# Altium project airu-board.PrjPcb
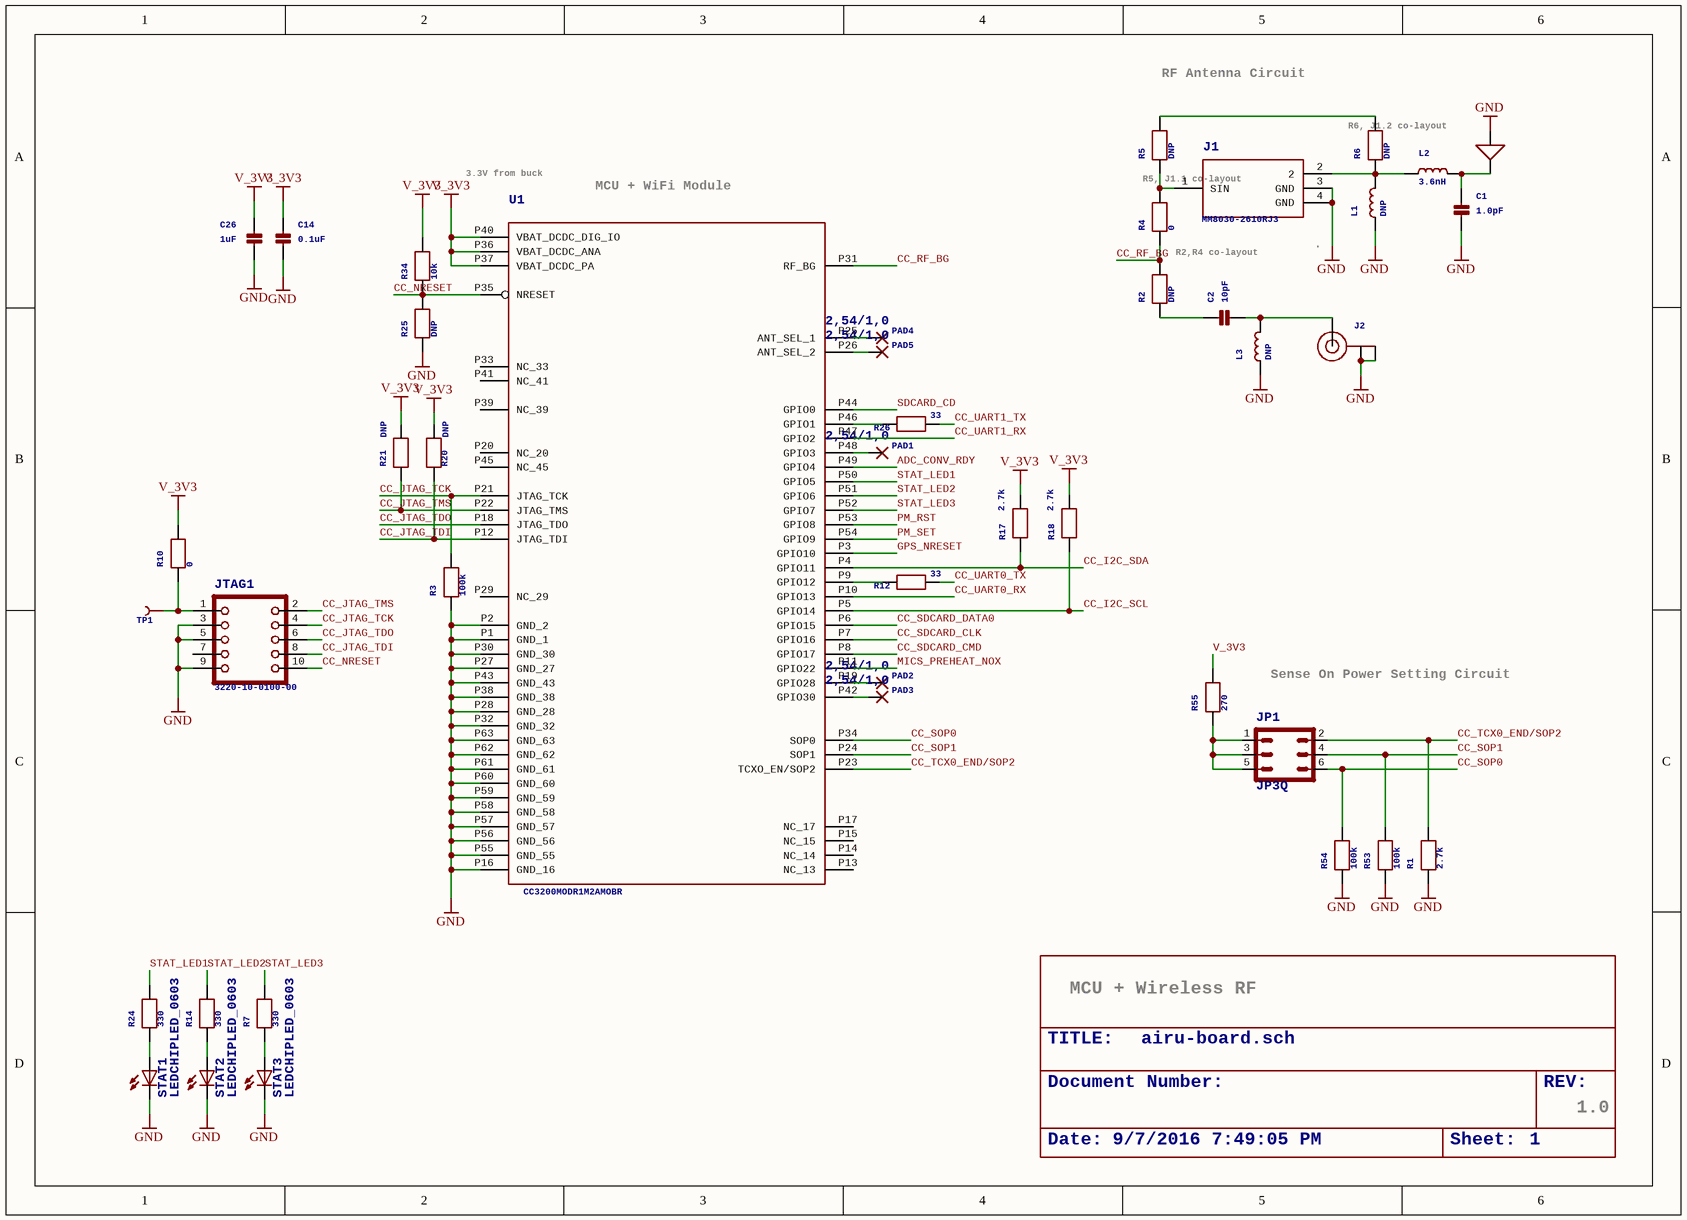
[diagram p0: airu-board_0.SchDoc]
3 sheets, 116 parts. Net scope: global (net labels, ports and power ports of the same name join across sheets).
Board file: airu-board.PcbDoc
Sheets:
  airu-board_0.SchDoc
  airu-board_1.SchDoc
  airu-board_2.SchDoc

## Sheet airu-board_0.SchDoc
size 296 x 213 mm

### Parts
C1  1.0pF  [0402]
C2  10pF  [0402]
C14  0.1uF  [0402]
C26  1uF  [0402]
E1  AH316M245001-T  [AH316M]  (value not drawn)
FRAME1  FRAME_A_L  (value not drawn)  (parts A,B of 2)
J1  MM8030-2610RJ3  [MURATA_MM8030-2610RJ3]
J2  U.FL-R-SMT-1(10)  [U.FL]  (value not drawn)
JP1  JP3Q  [JP3Q]
JTAG1  3220-10-0100-00  [CORTEXM3_SWD10_MOLEX]
L1  DNP  [_0402]
L2  3.6nH  [_0402]
L3  DNP  [_0402]
PAD1  2,54/1,0  [2,54/1,0]
PAD2  2,54/1,0  [2,54/1,0]
PAD3  2,54/1,0  [2,54/1,0]
PAD4  2,54/1,0  [2,54/1,0]
PAD5  2,54/1,0  [2,54/1,0]
R1  2.7k  [0402]
R2  DNP  [0402]
R3  100k  [0402]
R4  0  [0402]
R5  DNP  [0402]
R6  DNP  [0402]
R7  330  [0402]
R10  0  [0402]
R12  33  [0402]
R14  330  [0402]
R17  2.7k  [0402]
R18  2.7k  [0402]
R20  DNP  [0402]
R21  DNP  [0402]
R24  330  [0402]
R25  DNP  [0402]
R26  33  [0402]
R34  10k  [0402]
R53  100k  [0402]
R54  100k  [0402]
R55  270  [0402]
STAT1  LEDCHIPLED_0603  [CHIPLED_0603]
STAT2  LEDCHIPLED_0603  [CHIPLED_0603]
STAT3  LEDCHIPLED_0603  [CHIPLED_0603]
TP1  TEST-POINT2  [PAD.02X.02]  (value not drawn)
U1  CC3200MODR1M2AMOBR  [CC3200MOD]

### Nets
GND: C1.2(P$2) C14.2(P$2) C26.2(P$2) E1.P$2 J1.3(GND) J1.4(GND) J2.1(GND) J2.2(GND) JTAG1.3 JTAG1.5 JTAG1.9 L1.1 L3.1 R1.1 R3.1 R25.1 R53.1 R54.1 STAT1.C STAT2.C STAT3.C U1.P1(GND_1) U1.P2(GND_2) U1.P16(GND_16) U1.P27(GND_27) U1.P28(GND_28) U1.P30(GND_30) U1.P32(GND_32) U1.P38(GND_38) U1.P43(GND_43) U1.P55(GND_55) U1.P56(GND_56) U1.P57(GND_57) U1.P58(GND_58) U1.P59(GND_59) U1.P60(GND_60) U1.P61(GND_61) U1.P62(GND_62) U1.P63(GND_63)
V_3V3: C14.1(P$1) C26.1(P$1) R10.2 R17.2 R18.2 R20.2 R21.2 R34.2 R55.2 U1.P36(VBAT_DCDC_ANA) U1.P37(VBAT_DCDC_PA) U1.P40(VBAT_DCDC_DIG_IO)
ADC_CONV_RDY: U1.P49(GPIO4)
CC_I2C_SCL: R18.1 U1.P5(GPIO14)
CC_I2C_SDA: R17.1 U1.P4(GPIO11)
CC_JTAG_TCK: JTAG1.4 R3.2 U1.P21(JTAG_TCK)
CC_JTAG_TDI: JTAG1.8 R20.1 U1.P12(JTAG_TDI)
CC_JTAG_TDO: JTAG1.6 U1.P18(JTAG_TDO)
CC_JTAG_TMS: JTAG1.2 R21.1 U1.P22(JTAG_TMS)
CC_NRESET: JTAG1.10 R25.2 R34.1 U1.P35(NRESET)
CC_RF_BG: R2.2 R4.1 U1.P31(RF_BG)
CC_SDCARD_CLK: U1.P7(GPIO16)
CC_SDCARD_CMD: U1.P8(GPIO17)
CC_SDCARD_DATA0: U1.P6(GPIO15)
CC_SOP0: JP1.6 R54.2 U1.P34(SOP0)
CC_SOP1: JP1.4 R53.2 U1.P24(SOP1)
CC_TCX0_END/SOP2: JP1.2 R1.2 U1.P23(TCXO_EN/SOP2)
CC_UART0_RX: U1.P10(GPIO13)
CC_UART0_TX: R12.2
CC_UART1_RX: U1.P47(GPIO2)
CC_UART1_TX: R26.2
GPS_NRESET: U1.P3(GPIO10)
MICS_PREHEAT_NOX: U1.P11(GPIO22)
PM_RST: U1.P53(GPIO8)
PM_SET: U1.P54(GPIO9)
SDCARD_CD: U1.P44(GPIO0)
STAT_LED1: R24.2 U1.P50(GPIO5)
STAT_LED2: R14.2 U1.P51(GPIO6)
STAT_LED3: R7.2 U1.P52(GPIO7)
NetC1_1: C1.1(P$1) E1.P$1 L2.2
NetC2_1: C2.1(P$1) R2.1
NetC2_2: C2.2(P$2) J2.3(SIGNAL) L3.2
NetJ1_1: J1.1(SIN) R4.2 R5.1
NetJ1_2: J1.2 L1.2 L2.1 R6.1
NetJP1_1: JP1.1 JP1.3 JP1.5 R55.1
NetJTAG1_1: JTAG1.1 R10.1 TP1.P$1
NetPAD1_1: PAD1.1(P) U1.P48(GPIO3)
NetPAD2_1: PAD2.1(P) U1.P19(GPIO28)
NetPAD3_1: PAD3.1(P) U1.P42(GPIO30)
NetPAD4_1: PAD4.1(P) U1.P25(ANT_SEL_1)
NetPAD5_1: PAD5.1(P) U1.P26(ANT_SEL_2)
NetR5_2: R5.2 R6.2
NetR7_1: R7.1 STAT3.A
NetR12_1: R12.1 U1.P9(GPIO12)
NetR14_1: R14.1 STAT2.A
NetR24_1: R24.1 STAT1.A
NetR26_1: R26.1 U1.P46(GPIO1)

Not connected (* = marked no-connect by the designer): JTAG1 7; U1 P13(NC_13) P14(NC_14) P15(NC_15) P17(NC_17) P20(NC_20) P29(NC_29) P33(NC_33) P39(NC_39) P41(NC_41) P45(NC_45)

### Notes on the sheet
- (near R5) RF Antenna Circuit
- (near R6) R6, J1.2 co-layout
- 3.3V from buck
- (near U1) MCU + WiFi Module
- (near J1) R5, J1.1 co-layout
- R2,R4 co-layout
- Sense On Power Setting Circuit
- MCU + Wireless RF
- 1.0

### Library data of the parts
C1 C2 C14 C26 = CAP_CERAMIC0402: <p><b>Ceramic Capacitors</b></p> / <b>0402</b> - 0402 Surface Mount Capacitors / <ul> / <li>16pF 50V 5% [Digikey: 445-4899-2-ND]</li> / <li>18pF 50V 5% [Digikey: 490-1281-2-ND]</li> / <li>22pF 50V 5% [Digikey: 490-1283-2-ND]</li> / <li>68pF 50V 5% [Digikey: 490-1289-2-ND]</li> / <li>0.1uF 10V 10% [Digikey: 490-1318-2-ND]</li> / <li>1.0uF 6.3V 10% [Digikey: 490-1320-2-ND]</li> / </ul> / <b>0603</b> - 0603 Surface Mount Capacitors / <ul> / <li>16 pF 50V 5% [Digikey: 445-5051-2-ND]</li> / <li>22 pF 50V [Digikey: PCC220ACVTR-ND]</li> / <li>33 pF 50V 5% [Digikey: 490-1415-1-ND]</li> / <li>56pF 50V 5% [Digikey: 490-1421-1-ND]</li> / <li>220pF 50V 5% [Digikey: 445-1285-1-ND]</li> / <li>680 pF 50V </li> / <li>2200 pF 50V 5% C0G [Digikey: 445-1297-1-ND]</li> / <li>5600 pF 100V 5% X7R [Digikey: 478-3711-1-ND]</li> / <li>0.1 µF 25V 10% [Digikey: PCC2277TR-ND]</li> / <li>0.22 µF 16V 10% X7R [Digikey: 445-1318-1-ND]</li> / <li>1.0 µF 25V 10% [Digikey: 445-5146-2-ND]</li> / </ul> / <b>0603</b> - RF Specific / <ul> / <li>3pF 250V +/-0.1pF RF [Digikey: 712-1347-1-ND]</li> / <li>18 pF 250V 5%  [Digikey: 478-3505-1-ND or 712-1322-1-ND]</li> / <li>56 pF 250V 5% C0G RF [Digikey: 490-4867-1-ND]</li> / <li>68 pF 250V RF [Digikey: 490-4868-1-ND]</li> / </ul> / <b>0805</b> - 0805 Surface Mount Capacitors / <ul> / <li>220 pF 250V 2% <strong>RF</strong> Ceramic Capacitor [Digikey: 712-1398-1-ND]</li> / <li>1000 pF 50V 2% NP0 Ceramic Capacitor [Digikey: 478-3760-1-ND]</li> / <li>0.1 µF 25V 10% Ceramic Capacitor [Digikey: PCC1828TR-ND]</li> / <li>1.0 µF 16V 10% Ceramic Capacitor[Digikey: 490-1691-2-ND]</li> / <li>10.0 µF 10V 10% Ceramic Capacitor[Digikey: 709-1228-1-ND]</li> / <li>10.0 uF 16V 10% Ceramic Capacitor [Digikey: 478-5165-2-ND]</li> / <li>47 uF 6.3V 20% Ceramic Capacitor [Digikey: 587-1779-1-ND or 399-5506-1-ND]</li> / </ul> / </ul><b>1206</b> - 1206 Surface Mount Capacitors / <ul> / <li>47uF 10V 20% Ceramic Capacitor [Digikey: 490-5528-1-ND or 399-5508-1-ND or 445-6010-1-ND]</li> / <li>100uF 6.3V -20%, +80% Y5V Ceramic Capacitor (Digikey: 490-4512-1-ND, Mouser: 81-GRM31CF50J107ZE1L)</li> / </ul>
E1 = AH316M245001-T: ANT BLUETOOTH W-LAN ZIGBEE WIMAX
FRAME1 = FRAME_A_L: <b>FRAME</b> A Size , 8 1/2 x 11 INCH, Landscape<p>
J1 = MM8030-2610RJ3: Conn Coaxial RCP 0Hz to 11GHz 50Ohm Solder ST SMD Gold Reel
J2 = U.FL: <p>U.FL Antenna Connector</p>
JP1 = JP3Q: <b>JUMPER</b>
JTAG1 = JTAG-CORTEXM3MOLEX: <p><b>Serial Wire (SW-DP) Connector</b></p> / This standard 0.05" 10-pin connector is for use with the Cortex M0/M3's native SWD (serial wire debugger) interface (SW-DP).  Some boards support a 20-pin combined JTAG+SWD connector (SWJ-DP), such as the LPC1700 family, but many smaller devices only work with SWD which typically use the smaller 10-pin SW-DP connecter (the LPC1300 family, for example, only supports SWD). / <p><b>2x05 1.27mm/0.05" Connector:</b> This is the standard SMT connector defined by ARM for all Cortex devices, and should be used in most situations and for forward-compatibility since any new devices coming to market will likely use this connector.</p> / <p><b>MOLEX 10 Pin 0.1" Connector:</b> This 0.1" 10 pin connector has the same pin layout as the standard 0.05" connector, but is easier to work with if you are using standard jumper wires or custom cables to connect your SWD hardware.</p> / <p><b>MOLEX 20 Pin 0.1" Connector:</b> This 0.1" 20 pin connector is the same model used for ARM7/ARM9 JTAG debuggers, but is connected to match the pins on the Segger J-Link for ARM (which supports both JTAG and SWD debugging).</p> / <p>See the following document from ARM for more information on Cortex M3 Debug Connectors: http://infocenter.arm.com/help/topic/com.arm.doc.faqs/attached/13634/cortex_debug_connectors.pdf<br/>And the following page for an overview with images of the different connector types: http://www.keil.com/peripherals/coresight/connectors.asp</p>
L1-L3 = INDUCTOR_0402: <b>Inductors</b> / <p>0603:</p> / <ul> / <li>10nH Ceramic Inductor - microwire antenna/RF (Digikey: 712-1434-2-ND)</li> / </ul> / <p>0805:</p> / <ul> / <li>560nH Ceramic Inductor - RF (Digikey: 553-1047-1-ND)</li> / <li>270nH Ceramic Inductor - Q = 40@250MHz, +-5%, 1 Ohm DC Resistance (Digikey: 535-10506-2-ND)</li> / </ul> / <p>1007 (2518 Metric) SMT:</p> / <ul> / <li>10µH 10% 250mOhm 820mA 1007 Inductor (Digikey: 587-2189-1-ND)</li> / <li>22µH 10% 500mOhm 580mA 1007 Inductor (Digikey: 587-2190-1-ND)</li> / <li>47µH 10% 950mOhm 420mA 1007 Inductor (Digikey: 587-2191-1-ND)</li> / <li>47µH 5% 100mOhm 1A 1008 Inductor (Digikey: 732-1816-1-ND)</li> / </ul> / <p>5.0x5.0mm (Taiyo Yuden NR5040 Series)</p> / <ul> / <li>6.8µH 20% 2.3A 64mOhm Inductor (Digikey: 587-2374-2-ND)</li> / </ul> / <p>5.0x5.0mm (TDK VLC5045 Series)</p> / <ul> / <li>4.7µH 20% 3.3A 34mOhm Inductor (Digikey: 445-6526-1-ND)</li> / <li>6.8µH 20% 2.7A 46mOhm Inductor (Digikey: 445-6527-1-ND)</li> / </ul> / <p>6.0x6.0mm (TDK VLC6045 Series)</p> / <ul> / <li>4.7µH 20% 3.8A 27mOhm Inductor (Digikey: 445-6538-2-ND)</li> / <li>6.8µH 20% 3A 41mOhm Inductor (Digikey: 445-6540-1-ND)</li> / <li>6.2µH 30% 2.2A 45mOhm Inductor (Digikey: SRR5028-6R2YCT-ND) - Not TDK VLC6045 but footprint should match</li> / </ul> / <p>6.0x6.0mm (TDK SLF6045 Series)</p> / <ul> / <li>6.8uH 30% 2A 33mOhm Inductor (Digikey: 445-4572-1-ND, Mouser: 810-SLF645T6R8N2R0PF)</li> / </ul>
PAD1-PAD5 = 2,54/1,0: <b>THROUGH-HOLE PAD</b>
R1-R7 R10 R12 R14 R17 R18 R20 R21 R24-R26 R34 R53-R55 = RESISTOR0402: <p><b>Resistors</b></p> / <b>0402</b> - 0402 Surface Mount Package / <ul> / <li>22 Ohm 1% 1/16W [Digikey: 311-22.0LRTR-ND]</li> / <li>33 Ohm 5% 1/16W</li> / <li>1.0K 5% 1/16W</li> / <li>1.5K 5% 1/16W</li> / <li>2.0K 1% 1/16W</li> / <li>10.0K 1% 1/16W [Digikey: 311-10.0KLRTR-ND]</li> / <li>10.0K 5% 1/16W [Digikey: RMCF0402JT10K0TR-ND]</li> / <li>12.1K 1% 1/16W [Digikey: 311-22.0LRTR-ND]</li> / <li>100.0K 5% 1/16W</li> / </ul> / <b>0603</b> - 0603 Surface Mount Package<br> / <ul> / <li>0 Ohm 1/10 Watt 1% Resistor</li> / <li>15 Ohm 1/10 Watt 1% Resistor</li> / <li>33 Ohm 1/10 Watt 1% Resistor</li> / <li>49.9 Ohm 1/10 Watt 1% Resistor</li> / <li>100 Ohm 1/10 Watt 1% Resistor</li> / <li>150 Ohm 1/10 Watt 1% Resistor</li> / <li>240 Ohm 1/10 Watt 1% Resistor</li> / <li>390 Ohm 1/10 Watt 1% Resistor</li> / <li>560 Ohm 1/10 Watt 1% Resistor</li> / <li>680 Ohm 1/10 Watt 1% Resistor</li> / <li>750 Ohm 1/10 Watt 1% Resistor</li> / <li>1.0K Ohm 1/10 Watt 1% Resistor</li> / <li>1.5K Ohm 1/10 Watt 1% Resistor</li> / <li>2.0K Ohm 1/10 Watt 1% Resistor</li> / <li>2.2K Ohm 1/10 Watt 1% Resistor</li> / <li>3.3K Ohm 1/10 Watt 1% Resistor</li> / <li>4.7K Ohm 1/10 Watt 1% Resistor</li> / <li>10.0K Ohm 1/10 Watt 1% Resistor</li> / <li>12.0K Ohm 1/10 Watt 1% Resistor</li> / <li>12.1K Ohm 1/10 Watt 1% Resistor</li> / <li>20.0K Ohm 1/10 Watt 1% Resistor</li> / <li>33.0K Ohm 1/10 Watt 1% Resistor</li> / <li>100.0K Ohm 1/10 Watt 1% Resistor</li> / </ul> / <b>0805</b> - 0805 Surface Mount Package / <ul> / <li>0 Ohm 1/8 Watt 1% Resistor</li> / <li>33 Ohm 1/8 Watt 1% Resistor</li> / <li>100 Ohm 1/8 Watt 1% Resistor</li> / <li>150 Ohm 1/8 Watt 1% Resistor</li> / <li>200 Ohm 1/8 Watt 1% Resistor</li> / <li>240 Ohm 1/8 Watt 1% Resistor</li> / <li>330 Ohm 1/8 Watt 1% Resistor</li> / <li>390 Ohm 1/8 Watt 1% Resistor</li> / <li>470 Ohm 1/8 Watt 1% Resistor</li> / <li>1.0K Ohm 1/8 Watt 1% Resistor</li> / <li>1.5K Ohm 1/8 Watt 1% Resistor</li> / <li>2.0K Ohm 1/8 Watt 1% Resistor</li> / <li>4.7K Ohm 1/8 Watt 1% Resistor</li> / <li>5.1K Ohm 1/8 Watt 1% Resistor</li> / <li>5.6K Ohm 1/8 Watt 1% Resistor</li> / <li>10.0K Ohm 1/8 Watt 1% Resistor</li> / <li>22.0K Ohm 1/8 Watt 1% Resistor</li> / <li>33.0K Ohm 1/8 Watt 1% Resistor</li> / <li>100K Ohm 1/8 Watt 1% Resistor</li> / </ul> / <b>1206</b> - 1206 Surface Mount Package<br/> / <br/> / <b>2012</b> - 2010 Surface Mount Package<br/> / <ul><li>0.11 Ohm 1/2 Watt 1% Resistor - Digikey: RHM.11UCT-ND</li></ul>
STAT1-STAT3 = LEDCHIPLED_0603: <b>LED</b><p> / <u>OSRAM</u>:<br> / - <u>CHIPLED</u><br> / LG R971, LG N971, LY N971, LG Q971, LY Q971, LO R971, LY R971 / LH N974, LH R974<br> / LS Q976, LO Q976, LY Q976<br> / LO Q996<br> / - <u>Hyper CHIPLED</u><br> / LW Q18S<br> / LB Q993, LB Q99A, LB R99A<br> / - <u>SideLED</u><br> / LS A670, LO A670, LY A670, LG A670, LP A670<br> / LB A673, LV A673, LT A673, LW A673<br> / LH A674<br> / LY A675<br> / LS A676, LA A676, LO A676, LY A676, LW A676<br> / LS A679, LY A679, LG A679<br> / -  <u>Hyper Micro SIDELED®</u><br> / LS Y876, LA Y876, LO Y876, LY Y876<br> / LT Y87S<br> / - <u>SmartLED</u><br> / LW L88C, LW L88S<br> / LB L89C, LB L89S, LG L890<br> / LS L89K, LO L89K, LY L89K<br> / LS L896, LA L896, LO L896, LY L896<br> / - <u>TOPLED</u><br> / LS T670, LO T670, LY T670, LG T670, LP T670<br> / LSG T670, LSP T670, LSY T670, LOP T670, LYG T670<br> / LG T671, LOG T671, LSG T671<br> / LB T673, LV T673, LT T673, LW T673<br> / LH T674<br> / LS T676, LA T676, LO T676, LY T676, LB T676, LH T676, LSB T676, LW T676<br> / LB T67C, LV T67C, LT T67C, LS T67K, LO T67K, LY T67K, LW E67C<br> / LS E67B, LA E67B, LO E67B, LY E67B, LB E67C, LV E67C, LT E67C<br> / LW T67C<br> / LS T679, LY T679, LG T679<br> / LS T770, LO T770, LY T770, LG T770, LP T770<br> / LB T773, LV T773, LT T773, LW T773<br> / LH T774<br> / LS E675, LA E675, LY E675, LS T675<br> / LS T776, LA T776, LO T776, LY T776, LB T776<br> / LHGB T686<br> / LT T68C, LB T68C<br> / - <u>Hyper Mini TOPLED®</u><br> / LB M676<br> / - <u>Mini TOPLED Santana®</u><br> / LG M470<br> / LS M47K, LO M47K, LY M47K / <p> / Source: http://www.osram.convergy.de<p> / <u>LUXEON:</u><br> / - <u>LUMILED®</u><br> / LXK2-PW12-R00, LXK2-PW12-S00, LXK2-PW14-U00, LXK2-PW14-V00<br> / LXK2-PM12-R00, LXK2-PM12-S00, LXK2-PM14-U00<br> / LXK2-PE12-Q00, LXK2-PE12-R00, LXK2-PE12-S00, LXK2-PE14-T00, LXK2-PE14-U00<br> / LXK2-PB12-K00, LXK2-PB12-L00, LXK2-PB12-M00, LXK2-PB14-N00, LXK2-PB14-P00, LXK2-PB14-Q00<br> / LXK2-PR12-L00, LXK2-PR12-M00, LXK2-PR14-Q00, LXK2-PR14-R00<br> / LXK2-PD12-Q00, LXK2-PD12-R00, LXK2-PD12-S00<br> / LXK2-PH12-R00, LXK2-PH12-S00<br> / LXK2-PL12-P00, LXK2-PL12-Q00, LXK2-PL12-R00 / <p> / Source: www.luxeon.com<p> / <u>KINGBRIGHT:</U><p> / KA-3528ASYC<br> / Source: www.kingbright.com
TP1 = TEST-POINT2: Bare copper test points for troubleshooting or ICT
U1 = CC3200MOD: The CC3200MOD is a Wi-Fi Module that Consists of the CC3200R1M2RGC Single-Chip Wireless MCU. This Fully Integrated Module Includes all Required Clocks, SPI Flash, and Passives. / More information can be found at: http://www.ti.com/product/CC3200MOD/description.

## Sheet airu-board_1.SchDoc
size 296 x 230 mm
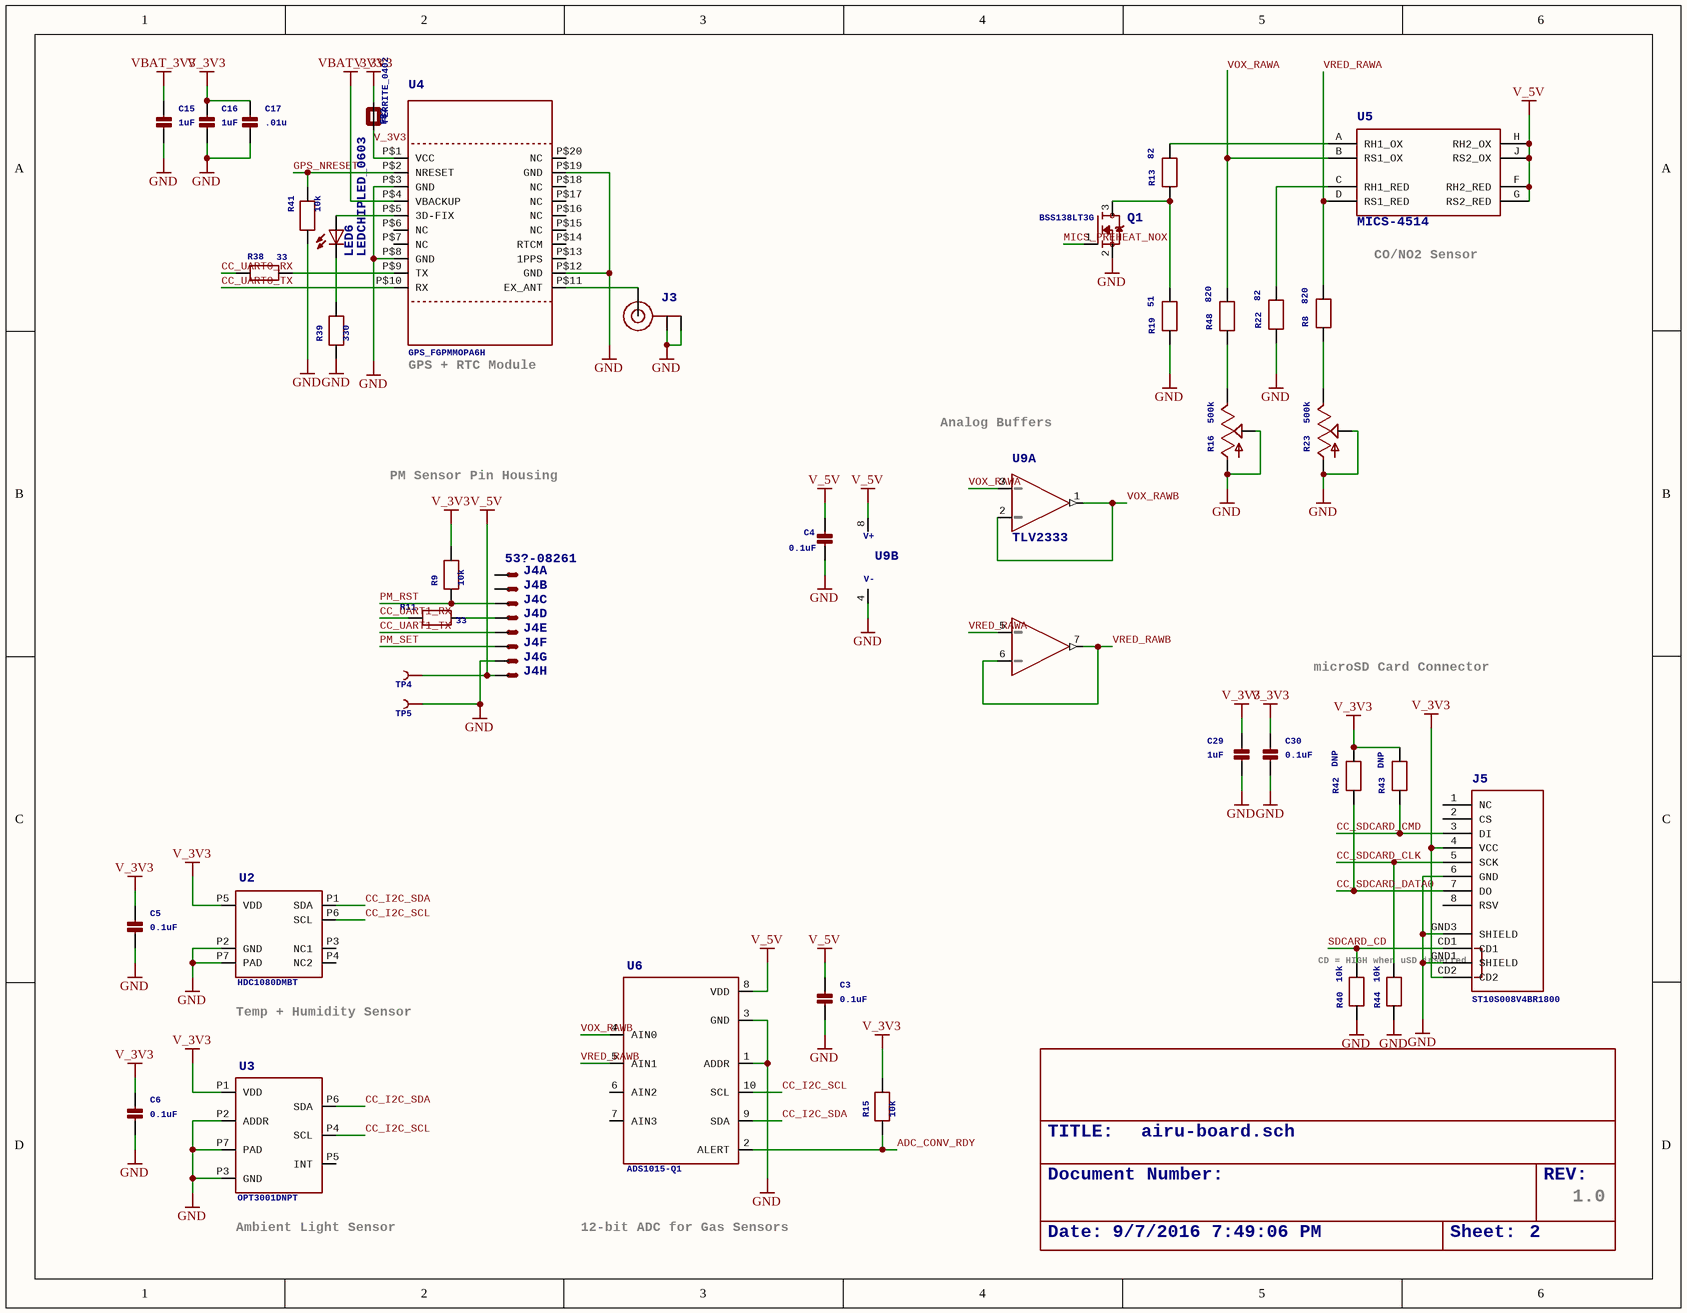
[diagram p1: airu-board_1.SchDoc]

### Parts
C3  0.1uF  [_0402]
C4  0.1uF  [_0402]
C5  0.1uF  [_0402]
C6  0.1uF  [_0402]
C15  1uF  [_0402]
C16  1uF  [_0402]
C17  .01u  [_0402]
C29  1uF  [_0402]
C30  0.1uF  [_0402]
FB2  FERRITE_0402  [_0402]
FRAME3  FRAME_A_L  (value not drawn)  (parts A,B of 2)
J3  U.FL-R-SMT-1(10)  [U.FL]  (value not drawn)
J4  53?-08261  [53261-08]  (parts A,B,C,D,E,F,G,H of 8)
J5  ST10S008V4BR1800  [MICROSD_1:1]
LED6  LEDCHIPLED_0603  [CHIPLED_0603]
Q1  BSS138LT3G  [SOT23]
R8  820  [0402]
R9  10k  [0402]
R11  33  [0402]
R13  82  [0402]
R15  10k  [0402]
R16  500k  [B25P]
R19  51  [0402]
R22  82  [0402]
R23  500k  [B25P]
R38  33  [0402]
R39  330  [0402]
R40  10k  [0402]
R41  10k  [0402]
R42  DNP  [0402]
R43  DNP  [0402]
R44  10k  [0402]
R48  820  [0402]
TP4  TEST-POINT2  [PAD.02X.02]  (value not drawn)
TP5  TEST-POINT2  [PAD.02X.02]  (value not drawn)
U2  HDC1080DMBT  [WSON]
U3  OPT3001DNPT  [USON]
U4  GPS_FGPMMOPA6H  [FGPMMOPA6H]
U5  MICS-4514  [MICS_10-SMD]
U6  ADS1015-Q1  [S-PDSO-G10]
U9  TLV2333  [DGK_S-PDSO-G8]  (parts A,B of 2)

### Nets
GND: C3.2(P$2) C4.2(P$2) C5.2(P$2) C6.2(P$2) C15.2(P$2) C16.2(P$2) C17.2(P$2) C29.2(P$2) C30.2(P$2) J3.1(GND) J3.2(GND) J4.7(S) J5.6(GND) J5.GND1(SHIELD) J5.GND3(SHIELD) Q1.2(S) R16.A R16.S R19.1 R22.1 R23.A R23.S R39.1 R40.1 R41.1 R44.1 TP5.P$1 U2.P2(GND) U2.P7(PAD) U3.P2(ADDR) U3.P3(GND) U3.P7(PAD) U4.P$3(GND) U4.P$8(GND) U4.P$12(GND) U4.P$19(GND) U6.1(ADDR) U6.3(GND) U9.4(V-)
V_3V3: C5.1(P$1) C6.1(P$1) C16.1(P$1) C17.1(P$1) C29.1(P$1) C30.1(P$1) FB2.1(P$1) FB2.2(P$2) J5.4(VCC) J5.CD2 R9.2 R15.2 R42.2 R43.2 U2.P5(VDD) U3.P1(VDD) U4.P$1(VCC)
V_5V: C3.1(P$1) C4.1(P$1) J4.8(S) TP4.P$1 U5.F(RH2_RED) U5.G(RS2_RED) U5.H(RH2_OX) U5.J(RS2_OX) U6.8(VDD) U9.8(V+)
VBAT_3V3: C15.1(P$1) U4.P$4(VBACKUP)
ADC_CONV_RDY: R15.1 U6.2(ALERT)
CC_I2C_SCL: U2.P6(SCL) U3.P4(SCL) U6.10(SCL)
CC_I2C_SDA: U2.P1(SDA) U3.P6(SDA) U6.9(SDA)
CC_SDCARD_CLK: J5.5(SCK) R44.2
CC_SDCARD_CMD: J5.3(DI) R43.1
CC_SDCARD_DATA0: J5.7(DO) R42.1
CC_UART0_RX: R38.1
CC_UART0_TX: U4.P$10(RX)
CC_UART1_RX: R11.1
CC_UART1_TX: J4.5(S)
GPS_NRESET: R41.2 U4.P$2(NRESET)
MICS_PREHEAT_NOX: Q1.1(G)
PM_RST: J4.3(S) R9.1
PM_SET: J4.6(S)
SDCARD_CD: J5.CD1 R40.2
VOX_RAWA: R48.2 U5.B(RS1_OX) U9.3(+)
VOX_RAWB: U6.4(AIN0) U9.1(OUT) U9.2(-)
VRED_RAWA: R8.2 U5.D(RS1_RED) U9.5(+1)
VRED_RAWB: U6.5(AIN1) U9.6(-1) U9.7(OUT1)
NetJ3_3: J3.3(SIGNAL) U4.P$11(EX_ANT)
NetJ4_4: J4.4(S) R11.2
NetLED6_A: LED6.A U4.P$5(3D-FIX)
NetLED6_C: LED6.C R39.2
NetQ1_3: Q1.3(D) R13.1 R19.2
NetR8_1: R8.1 R23.E
NetR13_2: R13.2 U5.A(RH1_OX)
NetR16_E: R16.E R48.1
NetR22_2: R22.2 U5.C(RH1_RED)
NetR38_2: R38.2 U4.P$9(TX)

Not connected (* = marked no-connect by the designer): J4 1(S) 2(S); J5 1(NC) 2(CS) 8(RSV); U2 P3(NC1) P4(NC2); U3 P5(INT); U4 P$6(NC) P$7(NC) P$13(1PPS) P$14(RTCM) P$15(NC) P$16(NC) P$17(NC) P$18(NC) P$20(NC); U6 6(AIN2) 7(AIN3)

### Notes on the sheet
- CO/NO2 Sensor
- GPS + RTC Module
- Analog Buffers
- PM Sensor Pin Housing
- microSD Card Connector
- CD = HIGH when uSD inserted.
- (near U2) Temp + Humidity Sensor
- (near U3) Ambient Light Sensor
- 12-bit ADC for Gas Sensors
- 1.0

### Library data of the parts
C3-C6 C15-C17 C29 C30 = CAP_CERAMIC_0402: <p><b>Ceramic Capacitors</b></p> / <b>0402</b> - 0402 Surface Mount Capacitors / <ul> / <li>16pF 50V 5% [Digikey: 445-4899-2-ND]</li> / <li>18pF 50V 5% [Digikey: 490-1281-2-ND]</li> / <li>22pF 50V 5% [Digikey: 490-1283-2-ND]</li> / <li>68pF 50V 5% [Digikey: 490-1289-2-ND]</li> / <li>0.1uF 10V 10% [Digikey: 490-1318-2-ND]</li> / <li>1.0uF 6.3V 10% [Digikey: 490-1320-2-ND]</li> / </ul> / <b>0603</b> - 0603 Surface Mount Capacitors / <ul> / <li>16 pF 50V 5% [Digikey: 445-5051-2-ND]</li> / <li>22 pF 50V [Digikey: PCC220ACVTR-ND]</li> / <li>33 pF 50V 5% [Digikey: 490-1415-1-ND]</li> / <li>56pF 50V 5% [Digikey: 490-1421-1-ND]</li> / <li>220pF 50V 5% [Digikey: 445-1285-1-ND]</li> / <li>680 pF 50V </li> / <li>2200 pF 50V 5% C0G [Digikey: 445-1297-1-ND]</li> / <li>5600 pF 100V 5% X7R [Digikey: 478-3711-1-ND]</li> / <li>0.1 µF 25V 10% [Digikey: PCC2277TR-ND]</li> / <li>0.22 µF 16V 10% X7R [Digikey: 445-1318-1-ND]</li> / <li>1.0 µF 25V 10% [Digikey: 445-5146-2-ND]</li> / </ul> / <b>0603</b> - RF Specific / <ul> / <li>3pF 250V +/-0.1pF RF [Digikey: 712-1347-1-ND]</li> / <li>18 pF 250V 5%  [Digikey: 478-3505-1-ND or 712-1322-1-ND]</li> / <li>56 pF 250V 5% C0G RF [Digikey: 490-4867-1-ND]</li> / <li>68 pF 250V RF [Digikey: 490-4868-1-ND]</li> / </ul> / <b>0805</b> - 0805 Surface Mount Capacitors / <ul> / <li>220 pF 250V 2% <strong>RF</strong> Ceramic Capacitor [Digikey: 712-1398-1-ND]</li> / <li>1000 pF 50V 2% NP0 Ceramic Capacitor [Digikey: 478-3760-1-ND]</li> / <li>0.1 µF 25V 10% Ceramic Capacitor [Digikey: PCC1828TR-ND]</li> / <li>1.0 µF 16V 10% Ceramic Capacitor[Digikey: 490-1691-2-ND]</li> / <li>10.0 µF 10V 10% Ceramic Capacitor[Digikey: 709-1228-1-ND]</li> / <li>10.0 uF 16V 10% Ceramic Capacitor [Digikey: 478-5165-2-ND]</li> / <li>47 uF 6.3V 20% Ceramic Capacitor [Digikey: 587-1779-1-ND or 399-5506-1-ND]</li> / </ul> / </ul><b>1206</b> - 1206 Surface Mount Capacitors / <ul> / <li>47uF 10V 20% Ceramic Capacitor [Digikey: 490-5528-1-ND or 399-5508-1-ND or 445-6010-1-ND]</li> / <li>100uF 6.3V -20%, +80% Y5V Ceramic Capacitor (Digikey: 490-4512-1-ND, Mouser: 81-GRM31CF50J107ZE1L)</li> / </ul>
FB2 = FERRITE_0402: <p><b>Ferrite Bead</b></p> / <p>0603</p> / <ul> / <li>MMZ1608B121C - 120 Ohm @ 100MHz, 600mA, 0.15 Ohm DC Resistance - Digikey: 445-2164-1-ND</li> / <li>BK1608HW121-T - 120 Ohm, 600mA Ferrite Chip - Digikey: 587-1876-2-ND</li> / </ul> / <p>0805</p> / <ul> / <li>HZ0805B272R-10 - 2.7K Ohm @ 100MHz, 200mA, 0.8 Ohm DC Resistance - Digikey: 240-2504-1-ND (see also Murata BLM21BD272SN1L)</li> / <li>MMZ2012Y152B - 1.5K Ohm @ 100MHz, 500mA, 0.4 Ohm DC Resistance - Digikey: 445-1560-1-ND - Mainly for high frequency (80-400MHz)</li> / <li>MMZ2012R102A - 1K Ohm @ 100MHz, 500mA, 0.3 Ohm DC Resistance - Digikey: 445-1555-2-ND - More general purpose (10-200MHz)</li> / </ul>
FRAME3 = FRAME_A_L: as FRAME1 on sheet airu-board_0
J3 = U.FL: <p>U.FL Antenna Connector</p>
J4 = 53?-08261: <b>CONNECTOR</b><p> / wire to board 1.25 mm (.049 inch) pitch header; OC_FARNELL: 1125376; OC_NEWARK: unknown
J5 = USD-SOCKET: <b>microSD Socket</b> / Push-push type uSD socket. Schematic element and footprint production proven. Spark Fun Electronics SKU : PRT-00127. tDoc lines correctly indicate media card edge positions when inserting (unlocked, locked, depressed). / NOTE: CD1 and CD2 are connected internally
LED6 = LEDCHIPLED_0603: as STAT1 on sheet airu-board_0
Q1 = MOSFET-NREFLOW: <b>N-Channel Mosfet</b> / <ul> / <li>2N7002E - 60V 260mA SOT23 [Digikey: 2N7002ET1GOSTR-ND] - <b>REEL</b></li> / <li>BSH103 - 30V 850mA SOT23 [Digikey: 568-5013-1-ND]</li> / </ul>
R8 R9 R11 R13 R15 R19 R22 R38-R44 R48 = RESISTOR0402: as R1 on sheet airu-board_0
R16 R23 = TRIM_US-B25P: <b>POTENTIOMETER</b>
TP4 TP5 = TEST-POINT2: as TP1 on sheet airu-board_0
U2 = HDC1080: The HDC1080 is a low power digital humidity sensor with integrated temperature sensor with excellent measurement accuracy . It operates over a wide supply range, and is a low cost, low power alternative to competitive solutions in a wide range of common applications. The humidity and temperature sensors are factory calibrated.
U3 = OPT3001: The OPT3001 is a single-chip lux meter, measuring the intensity of light as visible by the human eye.
U4 = GPS_FGPMMOPA6H: <b>GPS Module</b> - MTK MT3339 Chipset, -165dBm sensitivity, 22 channels, 10Hz, auto-select external antenna options
U5 = MICS-4514: Metal oxide MEMS carbon monoxide (CO) and NOx sensor in an SMD package.
U6 = ADS1015

## Sheet airu-board_2.SchDoc
size 296 x 229 mm
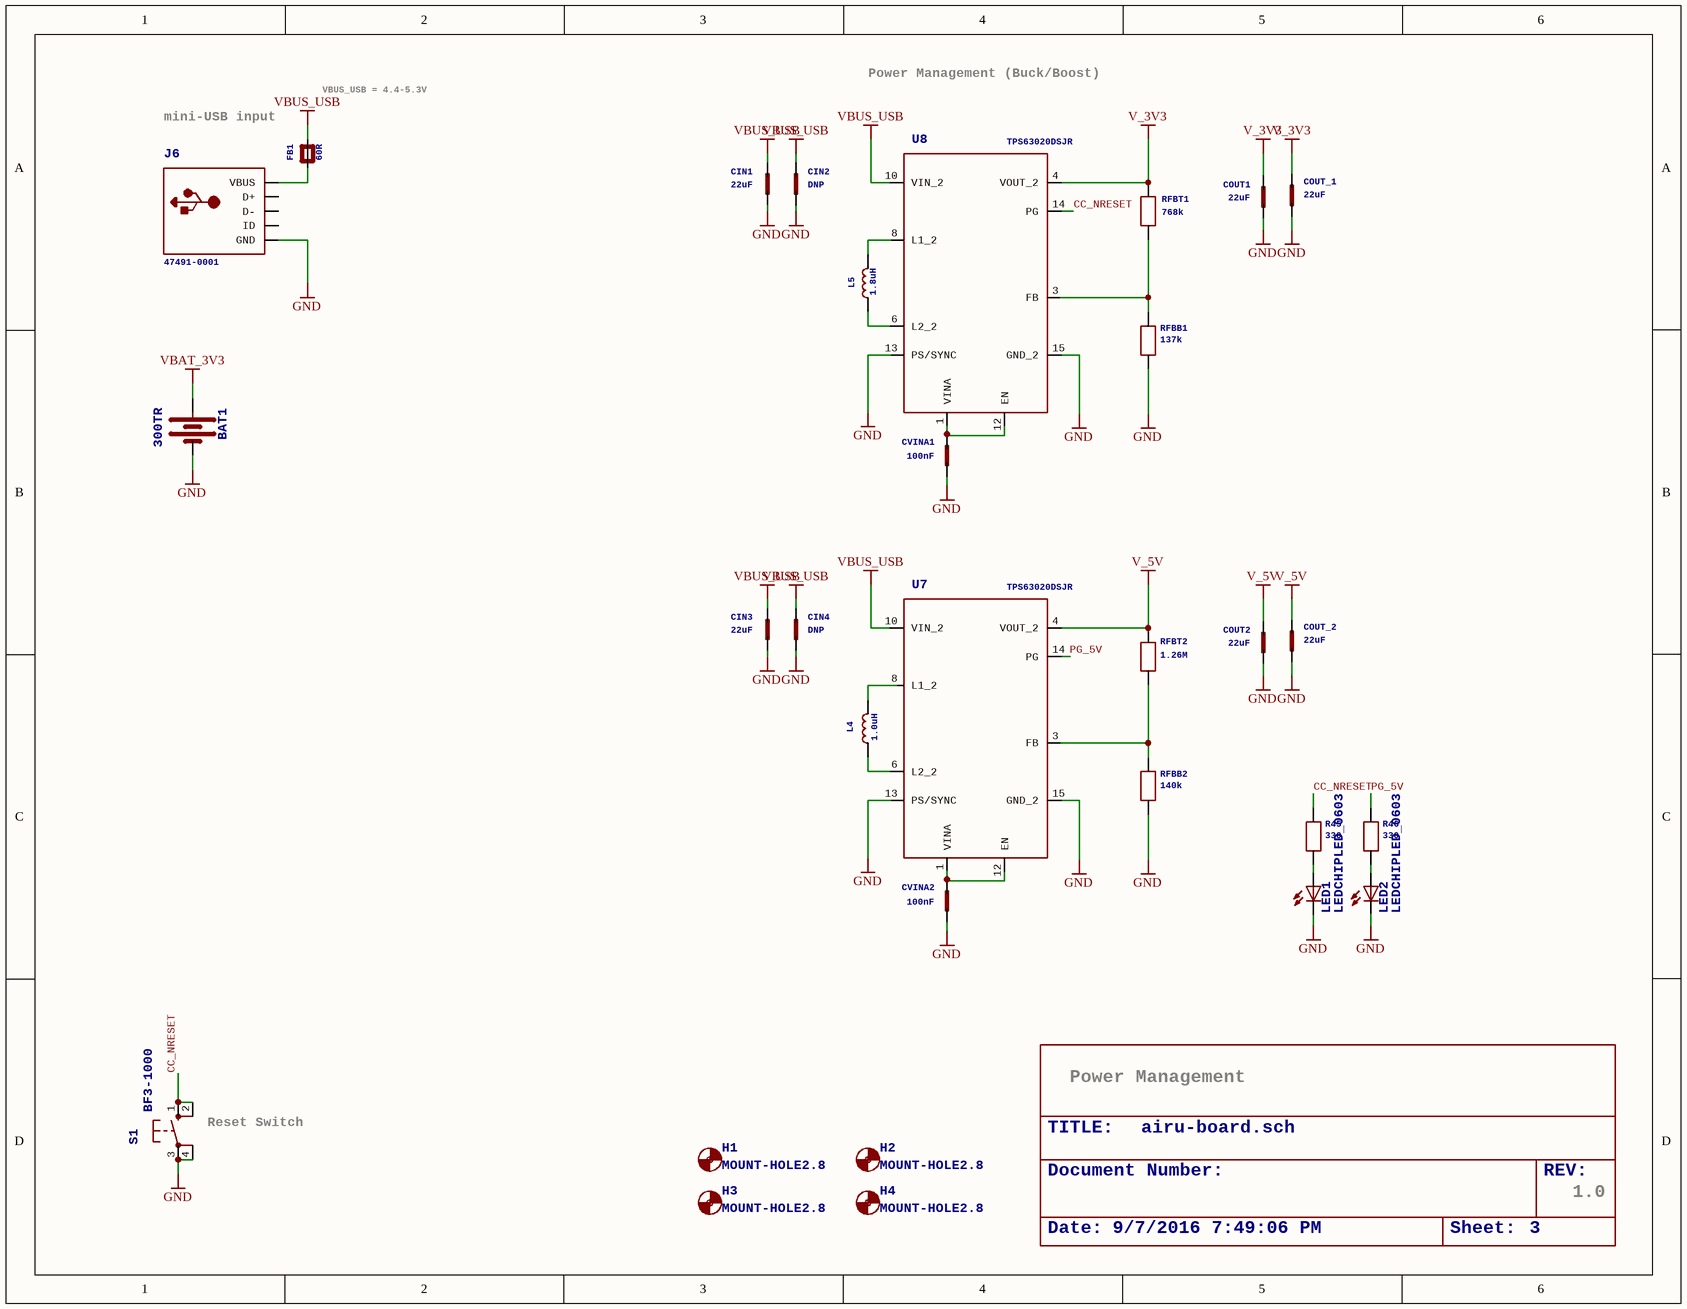
[diagram p2: airu-board_2.SchDoc]

### Parts
BAT1  300TR  [BATTCON_12MM]
CIN1  22uF  [1206_190]
CIN2  DNP  [1206_190]
CIN3  22uF  [1206_190]
CIN4  DNP  [1206_190]
COUT1  22uF  [0805]
COUT2  22uF  [0805]
COUT_1  22uF  [0805]
COUT_2  22uF  [0805]
CVINA1  100nF  [0603]
CVINA2  100nF  [0603]
FB1  60R  [_0402]
FRAME2  FRAME_A_L  (value not drawn)  (parts A,B of 2)
H1  MOUNT-HOLE2.8  [2,8]
H2  MOUNT-HOLE2.8  [2,8]
H3  MOUNT-HOLE2.8  [2,8]
H4  MOUNT-HOLE2.8  [2,8]
J6  47491-0001  [USB-MINIB]
L4  1.0uH  [SRN3015]
L5  1.8uH  [SDR0403]
LED1  LEDCHIPLED_0603  [CHIPLED_0603]
LED2  LEDCHIPLED_0603  [CHIPLED_0603]
R45  330  [0402]
R46  330  [0402]
RFBB1  137k  [0402]
RFBB2  140k  [0402]
RFBT1  768k  [0402]
RFBT2  1.26M  [0805]
S1  BF3-1000  [B3F-10XX]
U7  TPS63020DSJR  [R-PVSON-N14]
U8  TPS63020DSJR  [R-PVSON-N14]

### Nets
GND: BAT1.GND(-) CIN1.2 CIN2.2 CIN3.2 CIN4.2 COUT1.2 COUT2.2 COUT_1.2 COUT_2.2 CVINA1.2 CVINA2.2 J6.GND LED1.C LED2.C RFBB1.P2 RFBB2.P2 S1.3(P) S1.4(P1) U7.13(PS/SYNC) U7.15(GND_2) U8.13(PS/SYNC) U8.15(GND_2)
V_3V3: COUT1.1 COUT_1.1 RFBT1.P1 U8.4(VOUT_2)
V_5V: COUT2.1 COUT_2.1 RFBT2.1 U7.4(VOUT_2)
VBAT_3V3: BAT1.PWR@1(+)
VBUS_USB: CIN1.1 CIN2.1 CIN3.1 CIN4.1 FB1.2(P$2) U7.10(VIN_2) U8.10(VIN_2)
CC_NRESET: R45.P1 S1.1(S) S1.2(S1) U8.14(PG)
PG_5V: R46.P1 U7.14(PG)
NetCVINA1_1: CVINA1.1 U8.1(VINA) U8.12(EN)
NetCVINA2_1: CVINA2.1 U7.1(VINA) U7.12(EN)
NetFB1_1: FB1.1(P$1) J6.VBUS
NetL4_1: L4.1 U7.6(L2_2)
NetL4_2: L4.2 U7.8(L1_2)
NetL5_1: L5.1 U8.6(L2_2)
NetL5_2: L5.2 U8.8(L1_2)
NetLED1_A: LED1.A R45.P2
NetLED2_A: LED2.A R46.P2
NetRFBB1_P1: RFBB1.P1 RFBT1.P2 U8.3(FB)
NetRFBB2_P1: RFBB2.P1 RFBT2.2 U7.3(FB)

Not connected (* = marked no-connect by the designer): J6 D+ D- ID

### Notes on the sheet
- VBUS_USB = 4.4-5.3V
- Power Management (Buck/Boost)
- mini-USB input
- Power Management
- (near S1) Reset Switch
- 1.0

### Library data of the parts
BAT1 = BATTERY12MM: <b>Battery Holders</b><br> / Various common sizes : AA, AAA, 18650 (PRT-12895), 20mm coin cell and 12mm coin cell.<br> / 20MM_4LEGS, BATT-10373
CIN1-CIN4 = GRM31CR61A226KE19L
COUT1 COUT2 COUT_1 COUT_2 = GRM21BR60J226ME39L
CVINA1 CVINA2 = C0603C104K8RACTU
FB1 = FERRITE_0402: as FB2 on sheet airu-board_1
FRAME2 = FRAME_A_L: as FRAME1 on sheet airu-board_0
H1-H4 = MOUNT-HOLE2.8: <b>MOUNTING HOLE</b> with drill center marker
J6 = USBMINIB: <p><b>USB Connectors</b></p> / <b>USBMINIB</b> - Surface Mount Female Mini-B USB Connector 4UConnector: 06564</p> / <p>By microbuilder.eu</p> / Thru-hole RA Female Mini-B USB Connector 4UConnector: 18732</p> / <p>By ladyada.net</p>
L4 = SRN3015-1R0Y
L5 = SDR0403-1R8ML
LED1 LED2 = LEDCHIPLED_0603: as STAT1 on sheet airu-board_0
R45 R46 RFBB1 RFBB2 = CRCW0402137KFKED
RFBT1 = CRCW0402768KFKED
RFBT2 = RT0805BRD071M26L
S1 = 10-XX: <b>OMRON SWITCH</b>

## Nets that join several sheets
GND: airu-board_0 (39 pins), airu-board_1 (39 pins), airu-board_2 (22 pins)
V_3V3: airu-board_0 (12 pins), airu-board_1 (17 pins), airu-board_2 (COUT1.1 COUT_1.1 RFBT1.P1 U8.4)
V_5V: airu-board_1 (10 pins), airu-board_2 (COUT2.1 COUT_2.1 RFBT2.1 U7.4)
VBAT_3V3: airu-board_1 (C15.1 U4.P$4), airu-board_2 (BAT1.PWR@1)
ADC_CONV_RDY: airu-board_0 (U1.P49), airu-board_1 (R15.1 U6.2)
CC_I2C_SCL: airu-board_0 (R18.1 U1.P5), airu-board_1 (U2.P6 U3.P4 U6.10)
CC_I2C_SDA: airu-board_0 (R17.1 U1.P4), airu-board_1 (U2.P1 U3.P6 U6.9)
CC_NRESET: airu-board_0 (JTAG1.10 R25.2 R34.1 U1.P35), airu-board_2 (R45.P1 S1.1 S1.2 U8.14)
CC_SDCARD_CLK: airu-board_0 (U1.P7), airu-board_1 (J5.5 R44.2)
CC_SDCARD_CMD: airu-board_0 (U1.P8), airu-board_1 (J5.3 R43.1)
CC_SDCARD_DATA0: airu-board_0 (U1.P6), airu-board_1 (J5.7 R42.1)
CC_UART0_RX: airu-board_0 (U1.P10), airu-board_1 (R38.1)
CC_UART0_TX: airu-board_0 (R12.2), airu-board_1 (U4.P$10)
CC_UART1_RX: airu-board_0 (U1.P47), airu-board_1 (R11.1)
CC_UART1_TX: airu-board_0 (R26.2), airu-board_1 (J4.5)
GPS_NRESET: airu-board_0 (U1.P3), airu-board_1 (R41.2 U4.P$2)
MICS_PREHEAT_NOX: airu-board_0 (U1.P11), airu-board_1 (Q1.1)
PM_RST: airu-board_0 (U1.P53), airu-board_1 (J4.3 R9.1)
PM_SET: airu-board_0 (U1.P54), airu-board_1 (J4.6)
SDCARD_CD: airu-board_0 (U1.P44), airu-board_1 (J5.CD1 R40.2)